# Altium schematic sheet Sheet1.SchDoc
size B
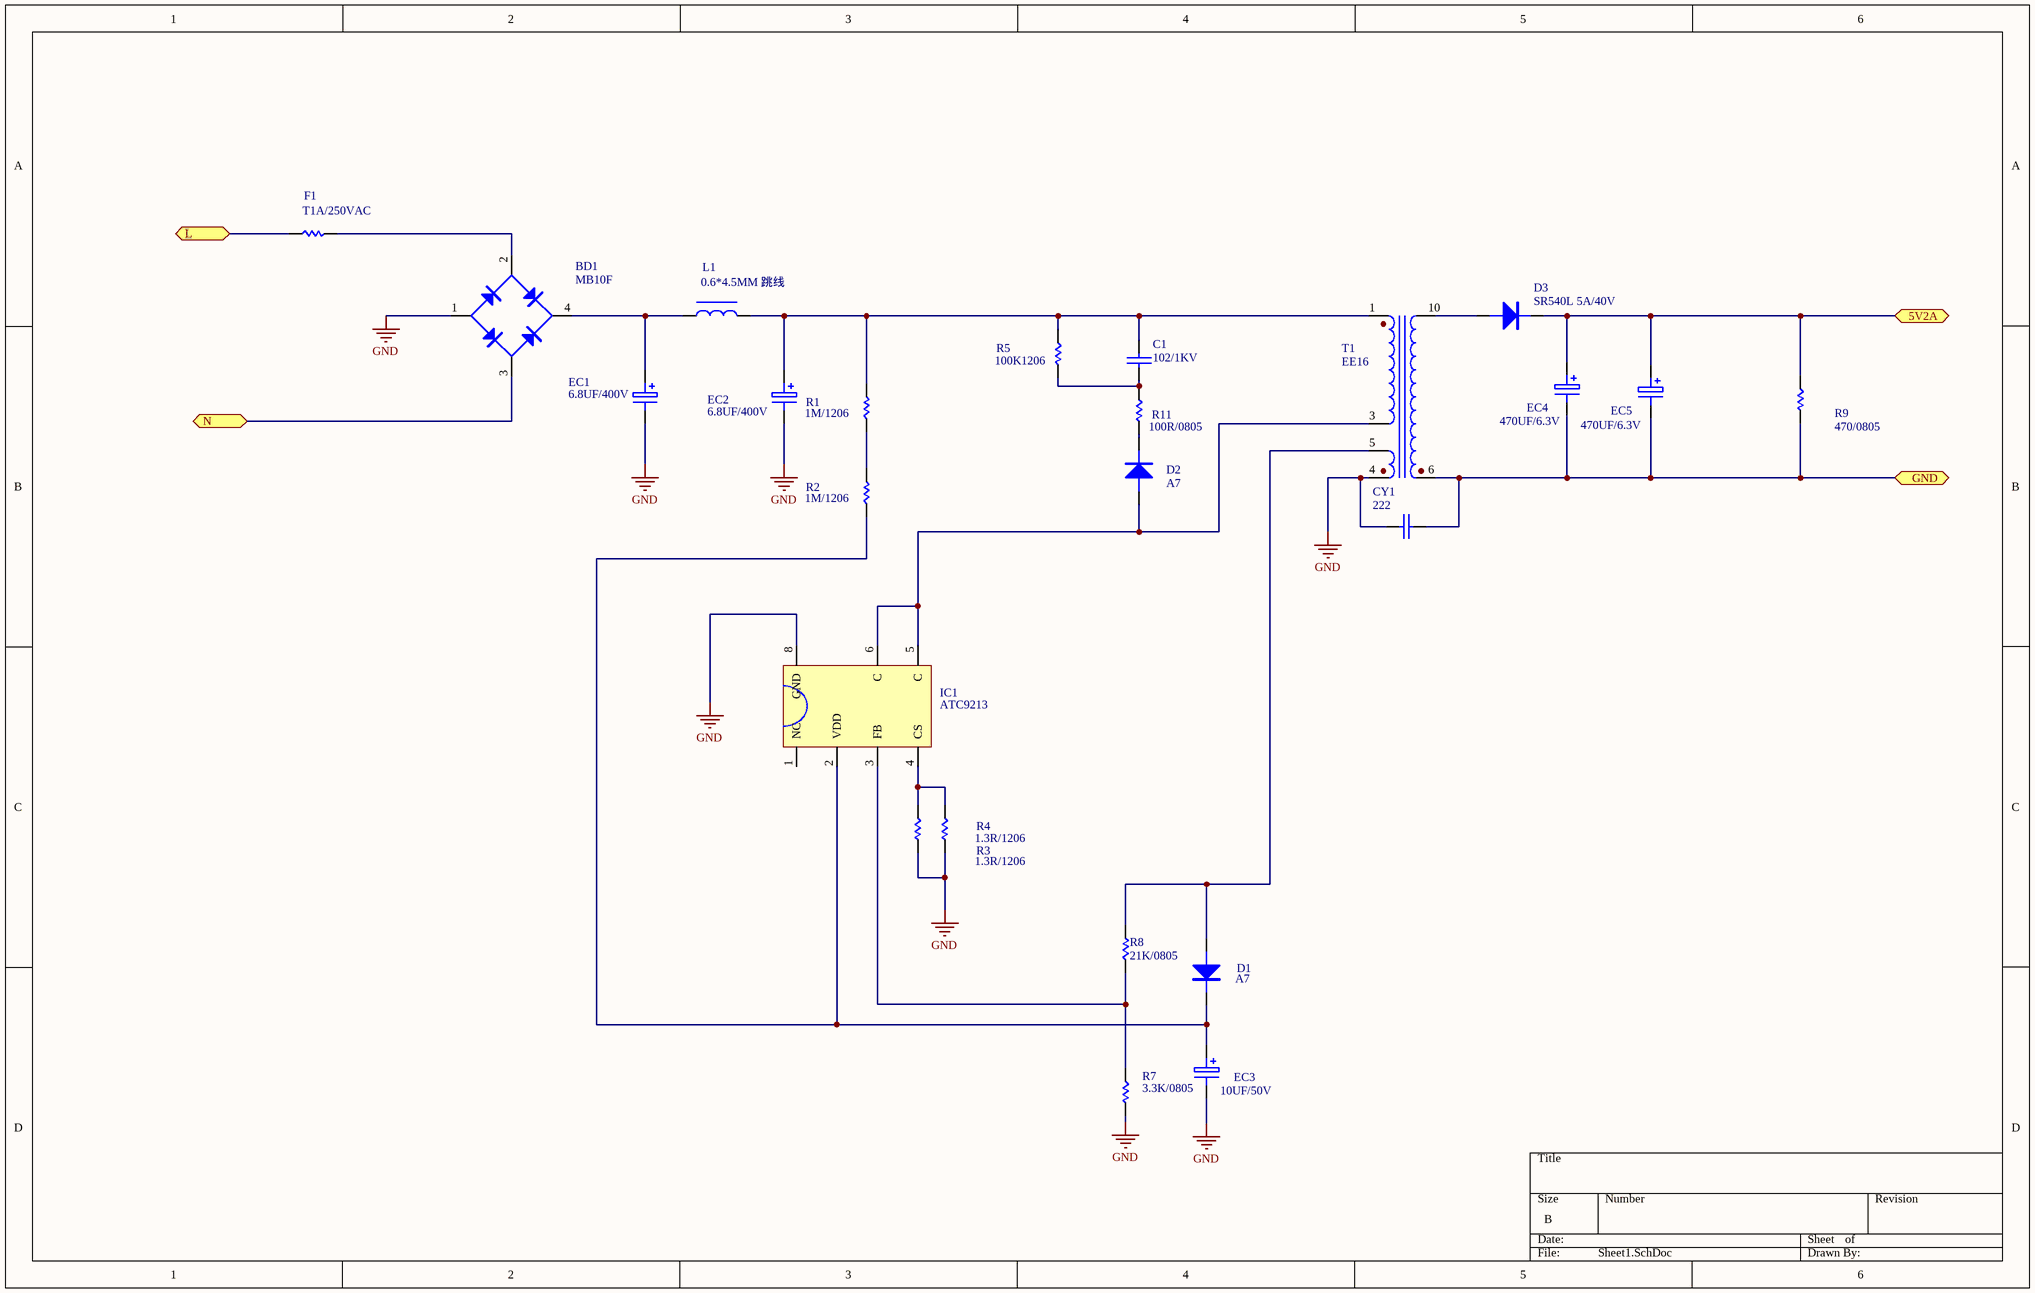
[diagram p0: Sheet1.SchDoc]

## Parts
BD1  MB10F
C1  102/1KV  [CC5]
CY1  222  [CY10]
D1  A7  [DO-41A]
D2  A7  [DO-41A]
D3  SR540L 5A/40V  [DO-41A]
EC1  6.8UF/400V  [EC-8]
EC2  6.8UF/400V  [EC-8]
EC3  10UF/50V  [EC-5]
EC4  470UF/6.3V  [EC-6]
EC5  470UF/6.3V  [EC-6]
F1  T1A/250VAC  [R1W]
IC1  ATC9213
L1  0.6*4.5MM 跳线
R1  1M/1206  [1206B]
R2  1M/1206  [1206B]
R3  1.3R/1206  [1206B]
R4  1.3R/1206  [1206B]
R5  100K1206  [1206B]
R7  3.3K/0805  [0805B]
R8  21K/0805  [0805B]
R9  470/0805  [0805B]
R11  100R/0805  [1206B]
T1  EE16  [EE13 4+4]

## Ports
5V2A, GND, L, N

## Nets
GND: BD1.1(V-) CY1.2 EC1.2 EC2.2 EC3.2 IC1.8(GND) R3.1 R4.1 R7.1 T1.4
5V2A: D3.2(K) EC4.1 EC5.1 R9.2 ; port 5V2A
GND: CY1.1 EC4.2 EC5.2 R9.1 T1.6 ; port GND  [a separate net that carries the same name]
L: F1.2 ; port L
N: BD1.3 ; port N
NetBD1_2: BD1.2 F1.1
NetBD1_4: BD1.4(V+) EC1.1 L1.1
NetC1_1: C1.1 EC2.1 L1.2 R1.1 R5.2 T1.1
NetC1_2: C1.2 R5.1 R11.2
NetD1_1: D1.1(A) R8.1 T1.5
NetD1_2: D1.2(K) EC3.1 IC1.2(VDD) R2.2
NetD2_1: D2.1(A) IC1.5(C) IC1.6(C) T1.3
NetD2_2: D2.2(K) R11.1
NetD3_1: D3.1(A) T1.10
NetIC1_3: IC1.3(FB) R7.2 R8.2
NetIC1_4: IC1.4(CS) R3.2 R4.2
NetR1_2: R1.2 R2.1

Not connected (* = marked no-connect by the designer): IC1 1(NC)

## Library data of the parts
BD1 = BD
C1 CY1 = CC
D1-D3 = D
EC1-EC5 = CE
F1 R1-R5 R7-R9 R11 = R
IC1 = DIP8
L1 = L
T1 = EFD25